# Altium project flatsat_platform_2.PrjPcb (part 2 of 3)

## Sheet power_schematic.SchDoc: Power circuits
size A3; ProjectCode: FLATSAT2; Organization: Altium Limited; Address1: L3, 12a Rodborough Rd; Address2: Frenchs Forest; Address3: NSW; Address4: Australia 2086; DocumentNumber: 6; SheetNumber: 6; SheetTotal: 8
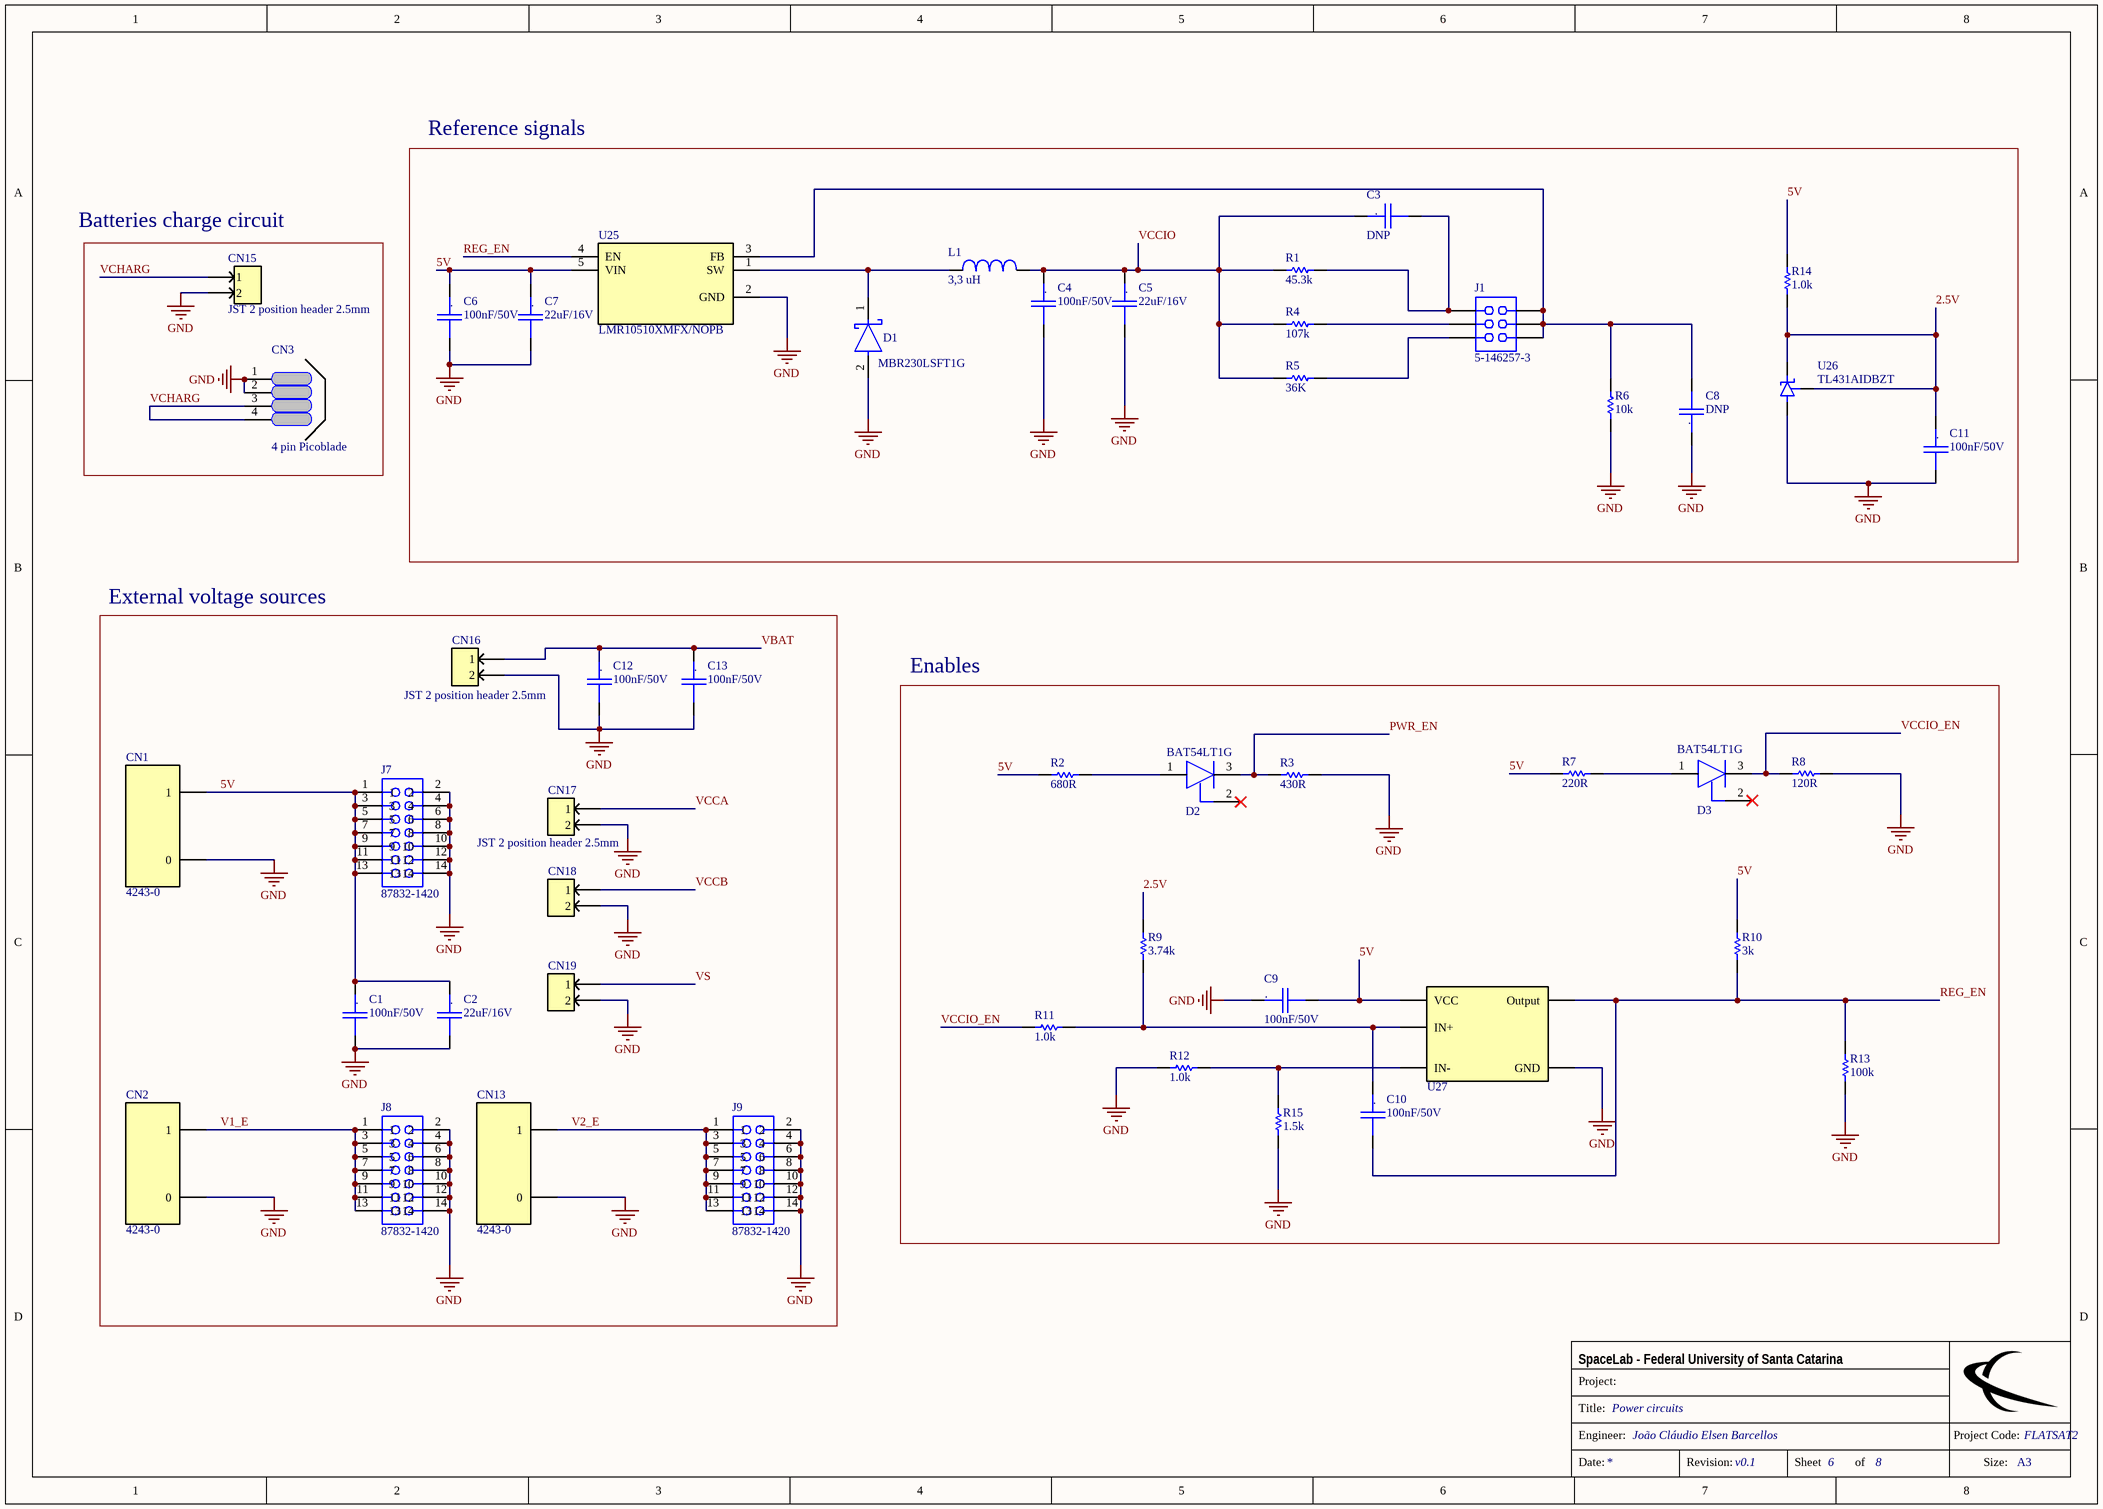
[diagram p7: power_schematic.SchDoc]

### Parts
C1  100nF/50V  [CC0603]
C2  22uF/16V  [CC1210]
C3  DNP  [CC0805]
C4  100nF/50V  [CC0603]
C5  22uF/16V  [CC1210]
C6  100nF/50V  [CC0603]
C7  22uF/16V  [CC1210]
C8  DNP  [CC0805]
C9  100nF/50V  [CC0603]
C10  100nF/50V  [CC0603]
C11  100nF/50V  [CC0603]
C12  100nF/50V  [CC0603]
C13  100nF/50V  [CC0603]
CN1  4243-0  [4243-0]
CN2  4243-0  [4243-0]
CN3  4 pin Picoblade  [PICO BLADE 0533980471]
CN13  4243-0  [4243-0]
CN15  JST 2 position header 2.5mm  [B2B-XH-A-M(LF)(SN)]
CN16  JST 2 position header 2.5mm  [B2B-XH-A-M(LF)(SN)]
CN17  JST 2 position header 2.5mm  [B2B-XH-A-M(LF)(SN)]
CN18  JST 2 position header 2.5mm  [B2B-XH-A-M(LF)(SN)]  (value not drawn)
CN19  JST 2 position header 2.5mm  [B2B-XH-A-M(LF)(SN)]  (value not drawn)
D1  MBR230LSFT1G  [On_Semiconductor_498_MFG]
D2  BAT54LT1G  [SOT95P237X112-3N]
D3  BAT54LT1G  [SOT95P237X112-3N]
J1  5-146257-3  [TE_5-146257-3]
J7  87832-1420  [SAMTEC_TSW-107-05-F-D]
J8  87832-1420  [SAMTEC_TSW-107-05-F-D]
J9  87832-1420  [SAMTEC_TSW-107-05-F-D]
L1  3,3 uH  [SRR6038]
R1  45.3k  [0805]
R2  680R  [0805]
R3  430R  [0805]
R4  107k  [0805]
R5  36K  [0805]
R6  10k  [0805]
R7  220R  [0805]
R8  120R  [0805]
R9  3.74k  [0805]
R10  3k  [0805]
R11  1.0k  [0805]
R12  1.0k  [0805]
R13  100k  [0805]
R14  1.0k  [0805]
R15  1.5k  [0805]
U25  LMR10510XMFX/NOPB  [SOT95P280X145-5N]
U26  TL431AIDBZT  [SOT95P237X112-3N]
U27  AP331AWG-7  [SOT95P280X145-5N]  (value not drawn)

### Blocks framed on the sheet
Reference signals: C3-C8 C11 D1 J1 L1 R1 R4-R6 R14 U25 U26
External voltage sources: C1 C2 C12 C13 CN1 CN2 CN13 CN16-CN19 J7-J9
Enables: C9 C10 D2 D3 R2 R3 R7-R13 R15 U27

### Nets
GND: C1.2 C2.2 C4.2 C5.2 C6.2 C7.2 C8.1 C9.1 C11.2 C12.2 C13.2 CN1.0 CN2.0 CN3.1 CN3.2 CN13.0 CN15.2 CN16.2 CN17.2 CN18.2 CN19.2 D1.2(A) J7.2 J7.4 J7.6 J7.8 J7.10 J7.12 J7.14 J8.2 J8.4 J8.6 J8.8 J8.10 J8.12 J8.14 J9.2 J9.4 J9.6 J9.8 J9.10 J9.12 J9.14 R3.1 R6.1 R8.1 R12.2 R13.1 R15.1 U25.2(GND) U26.3(ANODE) U27.2(GND)
2.5V: C11.1 R9.2 R14.1 U26.1(CATHODE) U26.2(REF)
5V: C1.1 C2.1 C6.1 C7.1 C9.2 CN1.1 J7.1 J7.3 J7.5 J7.7 J7.9 J7.11 J7.13 R2.2 R7.2 R10.2 R14.2 U25.5(VIN) U27.5(VCC)
PWR_EN: D2.3(C) R3.2
REG_EN: C10.2 R10.1 R13.2 U25.4(EN) U27.4(Output)
V1_E: CN2.1 J8.1 J8.3 J8.5 J8.7 J8.9 J8.11 J8.13
V2_E: CN13.1 J9.1 J9.3 J9.5 J9.7 J9.9 J9.11 J9.13
VBAT: C12.1 C13.1 CN16.1
VCCA: CN17.1
VCCB: CN18.1
VCCIO: C3.1 C4.1 C5.1 L1.2 R1.2 R4.2 R5.2
VCCIO_EN: D3.3(C) R8.2 R11.2
VCHARG: CN3.3 CN3.4 CN15.1
VS: CN19.1
NetC3_2: C3.2 J1.1 R1.1
NetC8_2: C8.2 J1.2 J1.4 J1.6 R6.2 U25.3(FB)
NetC10_1: C10.1 R9.1 R11.1 U27.3(IN+)
NetD1_1: D1.1(C) L1.1 U25.1(SW)
NetD2_1: D2.1(A) R2.1
NetD3_1: D3.1(A) R7.1
NetJ1_3: J1.3 R4.1
NetJ1_5: J1.5 R5.1
NetR12_1: R12.1 R15.2 U27.1(IN-)

Not connected (* = marked no-connect by the designer): D2 2(NC)*; D3 2(NC)*

### Notes on the sheet
- (near CN15) Batteries charge circuit
- Project:
- SpaceLab - Federal University of Santa Catarina
- Title:
- Engineer:
- Project Code:
- Date:
- Revision:
- Sheet
- of
- Size:
- A3
- (in symbol Cap_Cer_X7R_22uF_16V_1210) .
- (in symbol Cap_Cer_X7R_100nF_50V_0603) .
- (in symbol Cap_DNP_0805) .

### Library data of the parts
C1 C4 C6 C9-C13 = Cap_Cer_X7R_100nF_50V_0603: CAP CER 100nF 50V 10% X7R 0603; Manufacturer Part Number: C0603C104K5RAC3121; NCM: 8532.24.10
C2 C5 C7 = Cap_Cer_X7R_22uF_16V_1210: CAP CER 22uF 16V 10% X7R 1210; Manufacturer Part Number: C3225X7R1C226K250AC; NCM: 8532.24.10
C3 C8 = Cap_DNP_0805: CAP DNP 0805; NCM: 8532.24.10
CN1 CN2 CN13 = 4243-0: POMONA, 4243-0, Binding Post, 4243 Series, 15 A, 60 VDC, Tin Plated Contacts, Brass, Black; Manufacturer: Pomona Electronics; Voltage Rating: 2.5kV; Current Rating: 15A; Voltage Rating (DC): 60V; Voltage Rating (AC): 30V; Insulation: Insulated; Number of Ports: 2; Hole Diameter: 0.1inch; Panel Thickness: 6.35mm; Supplier 1: Digi-Key; Manufacturer Part Number: 4243-0; RoHS: Yes; Category: Connectors; Stock 1: 327; Pricing 1: 1=8.99000, 25=8.54040, 50=8.09100, 100=7.73150 (USD); Mount: Panel; Number of Pins: 1; Contact Plating: Tin,Bright; Contact Material: Brass; Color: Black,Red; Housing Material: Polycarbonate; Housing Color: Black; Body Material: Brass; Insulation Material: Polycarbonate; Package Quantity: 5; Packaging: Bulk; Termination: Turret; Orientation: Straight; Max Current Rating: 15A; Length: 30.23mm; Depth: 11.18mm; REACH SVHC: No SVHC; Lead Free: Lead Free; ComponentLink1URL: https://datasheet.ciiva.com/1453/d4243-1-01-1453890.pdf?src-supplier=Element14; ComponentLink1Description: https://datasheet.ciiva.com/1453/d4243-1-01-1453890.pdf?src-supplier=Element14; ComponentLink2URL: https://datasheet.ciiva.com/16883/70198115-16883751.pdf?src-supplier=Allied+Electronics; ComponentLink2Description: https://datasheet.ciiva.com/16883/70198115-16883751.pdf?src-supplier=Allied+Electronics; ComponentLink3URL: https://datasheet.ciiva.com/30105/d4243-1-02-30105753.pdf?src-supplier=Onlinecomponents.com; ComponentLink3Description: https://datasheet.ciiva.com/30105/d4243-1-02-30105753.pdf?src-supplier=Onlinecomponents.com; Supplier Part Number 1: 501-1126-ND
CN3 = 0533980471: 1.25mm Pitch PicoBlade™ Header, Surface Mount, Vertical, 4 Circuits; Manufacturer: Molex; Manufacturer Part Number: 53398-0471; N of Positions: 4; Body Plating: Tin; Gender: Male; Current Rating: 1A; Voltage Rating: 125V; Contact Resistance: 20mR; Insulation Resistance: 100MR; Glow Wire Compliant: Non-compliant; Pitch: 1.25mm; Mount Type: SMD; Value: 0533980471; Supplier 1: Digi-Key; Supplier Part Number 1: WM7608CT-ND; Stock 1: 21236; Pricing 1: 1=1.19, 10=1.044, 100=0.901, 500=0.73716 (USD); Mount: Surface Mount; Contact Plating: Tin; Contact Material: Bronze,Tin,Brass; Color: Natural; Housing Color: Natural; Housing Material: Nylon; Min Operating Temperature: -40°C; Max Operating Temperature: 85°C; Number of Rows: 1; Packaging: Tape and Reel; Number of Positions: 4; Termination: Solder; Package Quantity: 1000; Voltage Rating (AC): 125V; Number of Contacts: 4; Working Voltage: 125V; Orientation: Vertical; Number of Circuits: 4; Voltage Rating (DC): 125V; Lead Pitch: 1.25mm; Radiation Hardening: No; Flammability Rating: UL94 V-0; REACH SVHC: Unknown; Lead Free: Lead Free; ComponentLink1URL: http://www.mouser.com/ds/2/276/0533980471_PCB_HEADERS-171069.pdf?src-supplier=Mouser; ComponentLink1Description: http://www.mouser.com/ds/2/276/0533980471_PCB_HEADERS-171069.pdf?src-supplier=Mouser; ComponentLink2URL: http://www.jameco.com/Jameco/Products/ProdDS/1932627.pdf?src-supplier=Jameco; ComponentLink2Description: http://www.jameco.com/Jameco/Products/ProdDS/1932627.pdf?src-supplier=Jameco; ComponentLink3URL: https://www.distrelec.biz/Web/Downloads/46/_e/gf116833-116846_e.pdf?mime=application%2Fpdf&src-supplier=Distrelec; ComponentLink3Description: https://www.distrelec.biz/Web/Downloads/46/_e/gf116833-116846_e.pdf?mime=application%2Fpdf&src-supplier=Distrelec; ComponentLink4URL: http://www.molex.com/webdocs/datasheets/pdf/en-us/0533980471_PCB_HEADERS.pdf?src-supplier=Element14; ComponentLink4Description: http://www.molex.com/webdocs/datasheets/pdf/en-us/0533980471_PCB_HEADERS.pdf?src-supplier=Element14; ComponentLink5URL: http://www.farnell.com/datasheets/1867381.pdf?src-supplier=Element14; ComponentLink5Description: http://www.farnell.com/datasheets/1867381.pdf?src-supplier=Element14; ComponentLink6URL: http://uk.rs-online.com/webdocs/13c4/0900766b813c4500.pdf?src-supplier=RSComponents; ComponentLink6Description: http://uk.rs-online.com/webdocs/13c4/0900766b813c4500.pdf?src-supplier=RSComponents; ComponentLink7URL: http://www.molex.com/webdocs/datasheets/pdf/en-us/0533980471_PCB_HEADERS.pdf?src-supplier=Farnell; ComponentLink7Description: http://www.molex.com/webdocs/datasheets/pdf/en-us/0533980471_PCB_HEADERS.pdf?src-supplier=Farnell; ComponentLink8URL: http://www.farnell.com/datasheets/2697809.pdf?src-supplier=Element14; ComponentLink8Description: http://www.farnell.com/datasheets/2697809.pdf?src-supplier=Element14; ComponentLink9URL: http://www.molex.com/webdocs/datasheets/pdf/en-us/0533980471_PCB_HEADERS.pdf?src-supplier=Avnet; ComponentLink9Description: http://www.molex.com/webdocs/datasheets/pdf/en-us/0533980471_PCB_HEADERS.pdf?src-supplier=Avnet; ComponentLink10URL: http://www.molex.com/webdocs/datasheets/pdf/en-us/0533980471_PCB_HEADERS.pdf?src-supplier=Avnet+Europe; ComponentLink10Description: http://www.molex.com/webdocs/datasheets/pdf/en-us/0533980471_PCB_HEADERS.pdf?src-supplier=Avnet+Europe; Supplier 2: Mouser; Supplier Part Number 2: 538-53398-0471; Stock 2: 43680; Pricing 2: 1=0.98, 10=0.832, 100=0.716, 500=0.6, 1000=0.391, 2000=0.342 (USD)
CN15-CN19 = B2B-XH-A-M(LF)(SN): CONN HEADER TOP 2POS 2.5MM GRN; Number of Positions: 2; Connector Type: Male Pin; Pitch: 0.098inch; Supplier 1: Digi-Key; Supplier Part Number 1: 455-2879-ND; Manufacturer: JST; Stock 1: 5564; Pricing 1: 1=0.17, 10=0.157, 100=0.0966, 500=0.07998, 1000=0.06999, 5000=0.05999, 10000=0.05832 (USD); Mount: Through Hole; Color: Natural; Contact Plating: Tin; Packaging: Bulk; Number of Rows: 1; Termination: Press-Fit; Fastening Type: Detent; Package Quantity: 1000; Manufacturer Part Number: B2B-XH-A-M(LF)(SN); ComponentLink1Description: http://www.jst-mfg.com/product/pdf/eng/eXH.pdf; ComponentLink1URL: http://www.jst-mfg.com/product/pdf/eng/eXH.pdf
J1 = 5-146257-3: Header; Breakaway; 0.100 x 0.100 in.; PC Board; Dual; 6; 0.025 in.; 0.12 in.; Product_Type: Connector; Number_of_Positions: 6; MF: TE Connectivity; Centerline_Pitch: 2.54 mm[.1 in]; Package: None; EU_RoHS_Compliance: Compliant; DigiKey-Purchase-URL: https://snapeda.com/shop?store=DigiKey&id=338021; Value: *; Mouser-Purchase-URL: https://snapeda.com/shop?store=Mouser&id=338021; Availability: Warning; Price: None; SnapEDA_Link: https://www.snapeda.com/parts/5-146257-3/TE%20Connectivity%20AMP%20Connectors/view-part/338021/?ref=snap; Manufacturer Part Number: 5-146257-3
J7-J9 = 87832-1420: Connector Header Surface Mount 14 position 0.079 _2.00mm_; Manufacturer Part Number: TSW-107-05-F-D; MF: Molex; Value: *; SnapEDA_Link: https://www.snapeda.com/parts/87832-1420/Molex/view-part/78740/?ref=snap; Price: None; Package: None; Availability: Unavailable
L1 = 3,3 uH: 3.3ÂµH Shielded Wirewound Inductor 3.5A 20mOhm Max Nonstandard; Manufacturer Part Number: SRR6038-3R3Y; MF: Bourns; Value: *; Availability: Unavailable; Price: None; SnapEDA_Link: https://www.snapeda.com/parts/SRR6038-3R3Y/Bourns/view-part/885274/?ref=snap; Package: Nonstandard Bourns
R1 = R45.3k_1%_1/10W_0805: RES 45.3K OHM 1/8W 1% 0805; Manufacturer Part Number: RC0805FR-0745K3L; NCM: 8533.21.20
R2 = R680R_1%_1/8W_0805: RES 680R OHM 1/8W 1% 0805; Manufacturer Part Number: CRGCQ0805F680R; NCM: 8533.21.20
R3 = R430R_1%_1/4W_0805: RES 430R OHM 1/8W 0.1% 0805; Manufacturer Part Number: RT0805BRD07430RL; NCM: 8533.21.20
R4 = R107k_1%_1/8W_0805: RES 107K OHM 1/8W 1% 0805; Manufacturer Part Number: RC0805FR-07107KL; NCM: 8533.21.20
R5 = R36K_1%_1/10W_0805: RES 36K OHM 1/8W 0.1% 0805; Manufacturer Part Number: RG2012N-363-B-T5; NCM: 8533.21.20
R6 = R10k_1%_1/8W_0805: RES 10K OHM 1/8W 1%  0805; Manufacturer Part Number: CRCW080510K0FKEA; NCM: 8533.21.20
R7 = R220R_1%_1/8W_0805: RES 220R OHM 1/8W 1% 0805; Manufacturer Part Number: CRCW0805220RFKEA; NCM: 8533.21.20
R8 = R120R_1%_1/4W_0805: RES 120R OHM 1/8W 1% 0805; Manufacturer Part Number: CRGCQ0805F120R; NCM: 8533.21.20
R9 = R3.74k_1%_1/8W_0805: RES 3.74K OHM 1/8W 0.5% 0805; Manufacturer Part Number: RT0805DRE073K74L; NCM: 8533.21.20
R10 = R3.0k_1%_1/8W_0805: RES 3.0K OHM 1/10W 0.1% 0805; Manufacturer Part Number: ERA-6YEB302V; NCM: 8533.21.20
R11 R12 R14 = R1.0k_1%_1/8W_0805: RES 1.0K OHM 1/8W 1% 0805; Manufacturer Part Number: RC0805FR-071KL; NCM: 8533.21.20
R13 = R100k_1%_1/8W_0805: RES 100K OHM 1/8W 1% 0805; Manufacturer Part Number: AC0805FR-13100KL; NCM: 8533.21.20
R15 = R1.5K_1%_1/10W_0805: RES 1.5K OHM 1/10W 0.1% 0805; Manufacturer Part Number: RN73C2A1K5BTDF; NCM: 8533.21.20
U26 = TL431AIDBZT: Shunt Voltage Reference IC 36V Â±1% SOT-23-3; MF: Texas Instruments; SnapEDA_Link: https://www.snapeda.com/parts/TL431AIDBZT/Texas%20Instruments/view-part/277644/?ref=snap; Package: SOT-23-3 Texas Instruments; Price: None; Value: *; Availability: Unavailable; Manufacturer Part Number: TL431AIDBZT
D1 = MBR230LSFT1G: Manufacturer Part Number: MBR230LSFT1G
D2 D3 = BAT54LT1G: Manufacturer Part Number: BAT54LT1G
U25 = LMR10510XMFX/NOPB: Package: None; Price: None; Value: *; Availability: Unavailable; Manufacturer Part Number: LMR10510XMFX/NOPB
U27 = AP331AWG-7: Manufacturer Part Number: AP331AWG-7

## Sheet kill-switches_schematic.SchDoc: Kill-Switches
size A4; Organization: UFSC; DocumentNumber: 7; Revision: v0.1; SheetNumber: 7; SheetTotal: 8; ProjectCode: FLATSAT2
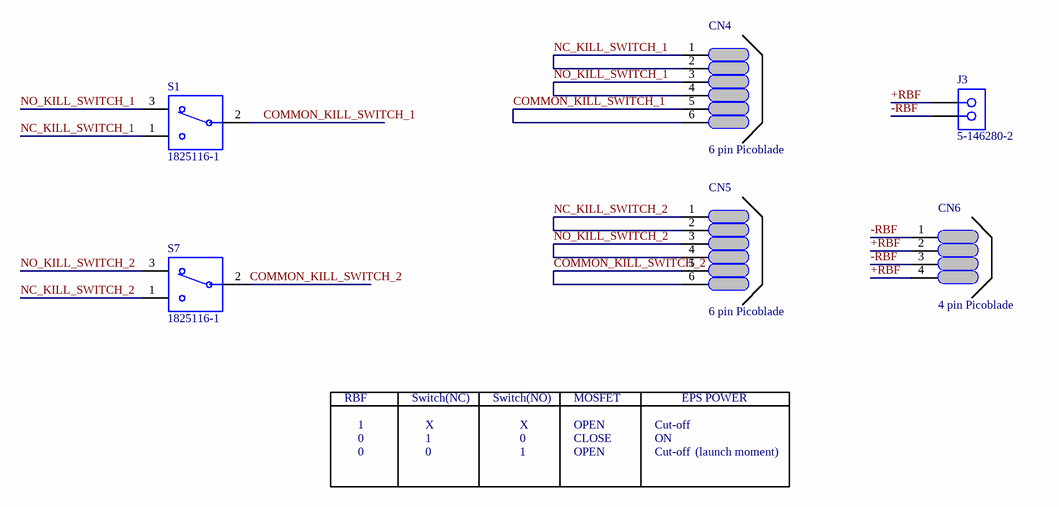
[diagram p8: kill-switches_schematic.SchDoc]

### Parts
CN4  6 pin Picoblade  [PICO BLADE 0533980671]
CN5  6 pin Picoblade  [PICO BLADE 0533980671]
CN6  4 pin Picoblade  [PICO BLADE 0533980471]
J3  5-146280-2  [PIN BAR 2 2.54mm 180 GRAUS]
S1  1825116-1  [SW_1825116-1]
S7  1825116-1  [SW_1825116-1]

### Nets
+RBF: CN6.2 CN6.4 J3.1
-RBF: CN6.1 CN6.3 J3.2
COMMON_KILL_SWITCH_1: CN4.5 CN4.6 S1.2
COMMON_KILL_SWITCH_2: CN5.5 CN5.6 S7.2
NC_KILL_SWITCH_1: CN4.1 CN4.2 S1.1
NC_KILL_SWITCH_2: CN5.1 CN5.2 S7.1
NO_KILL_SWITCH_1: CN4.3 CN4.4 S1.3
NO_KILL_SWITCH_2: CN5.3 CN5.4 S7.3

### Notes on the sheet
- RBF
- Switch(NC)
- Switch(NO)
- MOSFET
- EPS POWER
- 1
- 0
- X
- OPEN
- CLOSE
- Cut-off
- ON
- (launch moment)
- Project:
- SpaceLab - Federal University of Santa Catarina
- Title:
- Designed by:
- Project Code:
- Date:
- Revision:
- Sheet
- of
- Size:
- A4

### Library data of the parts
CN4 CN5 = 53398-0671: 1.25mm Pitch PicoBlade™ Header, Surface Mount, Vertical, 6 Circuits; Manufacturer: Molex; Body Plating: Tin; Contact Resistance: 20mR; Voltage Rating: 125V; Current Rating: 1A; Number of Positions: 6; Insulation Resistance: 100MR; Gender: Male; Glow Wire Compliant: Non-compliant; Supplier 1: Digi-Key; Supplier Part Number 1: WM7610DKR-ND; Stock 1: 21086; Pricing 1: 1=1.39, 10=1.26, 100=1.0802, 500=0.90014 (USD); Mount: Surface Mount; Color: Natural; Contact Plating: Tin; Contact Material: Bronze,Tin; Housing Color: Natural; Housing Material: Nylon; Min Operating Temperature: -40°C; Max Operating Temperature: 85°C; Packaging: Tape and Reel; Number of Rows: 1; Voltage Rating (AC): 125V; Package Quantity: 1000; Termination: Solder; Number of Contacts: 6; Working Voltage: 125V; Orientation: Vertical; Number of Circuits: 6; Voltage Rating (DC): 125V; Lead Pitch: 1.25mm; Pitch: 1.25mm; Radiation Hardening: No; REACH SVHC: Unknown; Lead Free: Lead Free; Flammability Rating: UL94 V-0; ComponentLink1URL: https://www.molex.com/pdm_docs/sd/533980671_sd.pdf?src-supplier=Digi-Key; ComponentLink1Description: https://www.molex.com/pdm_docs/sd/533980671_sd.pdf?src-supplier=Digi-Key; Supplier 2: Mouser; Supplier Part Number 2: 538-53398-0671; Stock 2: 26; Pricing 2: 1=1.15, 10=1.01, 100=0.864, 500=0.727, 1000=0.427, 2000=0.374 (USD); Manufacturer Part Number: 53398-0671
CN6 = 0533980471: as CN3 on sheet power_schematic; Pitch: 1.25mm; Mount Type: SMD; Value: 0533980471; Supplier 1: Digi-Key; Supplier Part Number 1: WM7608CT-ND; Stock 1: 21236; Pricing 1: 1=1.19, 10=1.044, 100=0.901, 500=0.73716 (USD); Mount: Surface Mount; Contact Plating: Tin; Contact Material: Bronze,Tin,Brass; Color: Natural; Housing Color: Natural; Housing Material: Nylon; Min Operating Temperature: -40°C; Max Operating Temperature: 85°C; Number of Rows: 1; Packaging: Tape and Reel; Number of Positions: 4; Termination: Solder; Package Quantity: 1000; Voltage Rating (AC): 125V; Number of Contacts: 4; Working Voltage: 125V; Orientation: Vertical; Number of Circuits: 4; Voltage Rating (DC): 125V; Lead Pitch: 1.25mm; Radiation Hardening: No; Flammability Rating: UL94 V-0; REACH SVHC: Unknown; Lead Free: Lead Free; ComponentLink1URL: http://www.mouser.com/ds/2/276/0533980471_PCB_HEADERS-171069.pdf?src-supplier=Mouser; ComponentLink1Description: http://www.mouser.com/ds/2/276/0533980471_PCB_HEADERS-171069.pdf?src-supplier=Mouser; ComponentLink2URL: http://www.jameco.com/Jameco/Products/ProdDS/1932627.pdf?src-supplier=Jameco; ComponentLink2Description: http://www.jameco.com/Jameco/Products/ProdDS/1932627.pdf?src-supplier=Jameco; ComponentLink3URL: https://www.distrelec.biz/Web/Downloads/46/_e/gf116833-116846_e.pdf?mime=application%2Fpdf&src-supplier=Distrelec; ComponentLink3Description: https://www.distrelec.biz/Web/Downloads/46/_e/gf116833-116846_e.pdf?mime=application%2Fpdf&src-supplier=Distrelec; ComponentLink4URL: http://www.molex.com/webdocs/datasheets/pdf/en-us/0533980471_PCB_HEADERS.pdf?src-supplier=Element14; ComponentLink4Description: http://www.molex.com/webdocs/datasheets/pdf/en-us/0533980471_PCB_HEADERS.pdf?src-supplier=Element14; ComponentLink5URL: http://www.farnell.com/datasheets/1867381.pdf?src-supplier=Element14; ComponentLink5Description: http://www.farnell.com/datasheets/1867381.pdf?src-supplier=Element14; ComponentLink6URL: http://uk.rs-online.com/webdocs/13c4/0900766b813c4500.pdf?src-supplier=RSComponents; ComponentLink6Description: http://uk.rs-online.com/webdocs/13c4/0900766b813c4500.pdf?src-supplier=RSComponents; ComponentLink7URL: http://www.molex.com/webdocs/datasheets/pdf/en-us/0533980471_PCB_HEADERS.pdf?src-supplier=Farnell; ComponentLink7Description: http://www.molex.com/webdocs/datasheets/pdf/en-us/0533980471_PCB_HEADERS.pdf?src-supplier=Farnell; ComponentLink8URL: http://www.farnell.com/datasheets/2697809.pdf?src-supplier=Element14; ComponentLink8Description: http://www.farnell.com/datasheets/2697809.pdf?src-supplier=Element14; ComponentLink9URL: http://www.molex.com/webdocs/datasheets/pdf/en-us/0533980471_PCB_HEADERS.pdf?src-supplier=Avnet; ComponentLink9Description: http://www.molex.com/webdocs/datasheets/pdf/en-us/0533980471_PCB_HEADERS.pdf?src-supplier=Avnet; ComponentLink10URL: http://www.molex.com/webdocs/datasheets/pdf/en-us/0533980471_PCB_HEADERS.pdf?src-supplier=Avnet+Europe; ComponentLink10Description: http://www.molex.com/webdocs/datasheets/pdf/en-us/0533980471_PCB_HEADERS.pdf?src-supplier=Avnet+Europe; Supplier 2: Mouser; Supplier Part Number 2: 538-53398-0471; Stock 2: 43680; Pricing 2: 1=0.98, 10=0.832, 100=0.716, 500=0.6, 1000=0.391, 2000=0.342 (USD)
J3 = 5-146280-2: 02 MODII HDR SRST B/A .100CL; MF: TE Connectivity; Product_Type: Connector; Number_of_Positions: 2; Centerline_Pitch: 2.54 mm[.1 in]; SnapEDA_Link: https://www.snapeda.com/parts/5-146280-2/TE%20Connectivity%20AMP%20Connectors/view-part/298520/?ref=snap; Price: None; EU_RoHS_Compliance: Compliant; Package: None; Availability: Unavailable; TE_purchase_URL: https://www.te.com/usa-en/product-5-146280-2.html?te_bu=Cor&te_type=disp&te_campaign=seda_glo_cor-seda-global-disp-prtnr-fy19-seda-model-bom-cta_sma-317_1&elqCampaignId=32493; Value: *; Manufacturer Part Number: 5-146280-2
S1 S7 = 1825116-1: Slide Switch SPDT Through Hole, Right Angle; MF: TE Connectivity; Price: None; Value: *; EU_RoHS_Compliance: Compliant; Package: None; TE_purchase_URL: https://www.te.com/usa-en/product-1825116-1.html?te_bu=Cor&te_type=disp&te_campaign=seda_glo_cor-seda-global-disp-prtnr-fy19-seda-model-bom-cta_sma-317_1&elqCampaignId=32493; SnapEDA_Link: https://www.snapeda.com/parts/1825116-1/TE%20Connectivity%20ALCOSWITCH%20Switches/view-part/497270/?ref=snap; Availability: Unavailable; Manufacturer Part Number: 1825116-1

## Sheet USB_debug_schematic.SchDoc: USB UART debug circuit
size A3; ProjectCode: FLATSAT2; Organization: Altium Limited; Address1: L3, 12a Rodborough Rd; Address2: Frenchs Forest; Address3: NSW; Address4: Australia 2086; DocumentNumber: 8; SheetNumber: 8; SheetTotal: 8
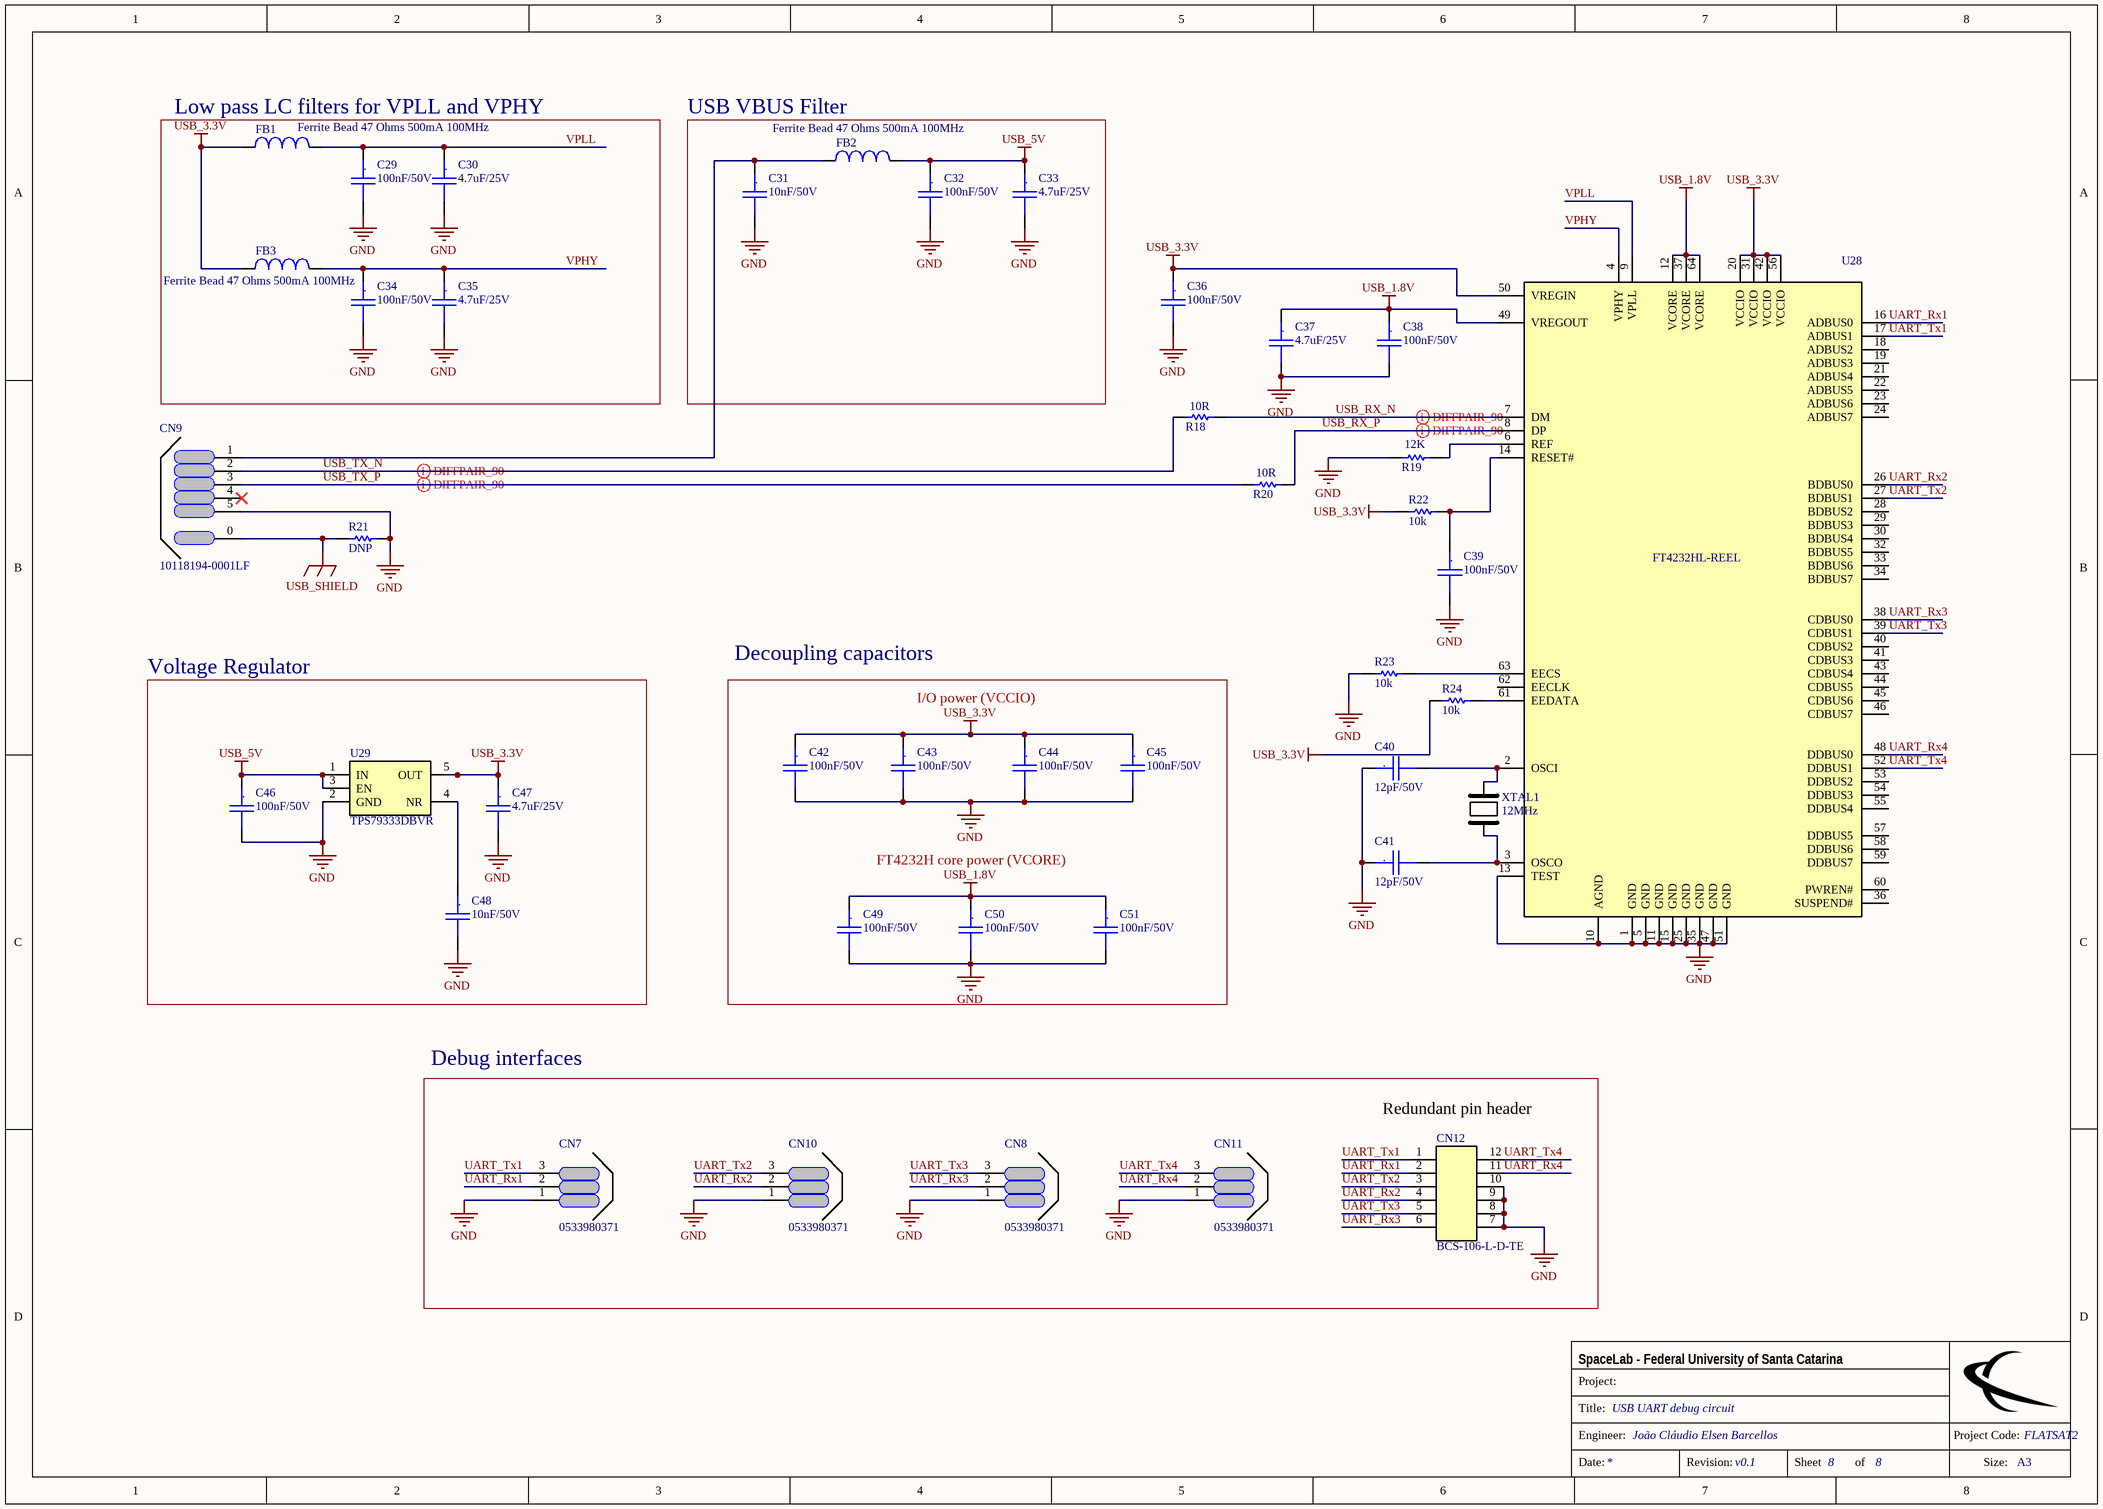
[diagram p9: USB_debug_schematic.SchDoc]

### Parts
C29  100nF/50V  [CC0603]
C30  4.7uF/25V  [CC0805]
C31  10nF/50V  [CC0805]
C32  100nF/50V  [CC0603]
C33  4.7uF/25V  [CC0805]
C34  100nF/50V  [CC0603]
C35  4.7uF/25V  [CC0805]
C36  100nF/50V  [CC0603]
C37  4.7uF/25V  [CC0805]
C38  100nF/50V  [CC0603]
C39  100nF/50V  [CC0603]
C40  12pF/50V  [CC0805]
C41  12pF/50V  [CC0805]
C42  100nF/50V  [CC0603]
C43  100nF/50V  [CC0603]
C44  100nF/50V  [CC0603]
C45  100nF/50V  [CC0603]
C46  100nF/50V  [CC0603]
C47  4.7uF/25V  [CC0805]
C48  10nF/50V  [CC0805]
C49  100nF/50V  [CC0603]
C50  100nF/50V  [CC0603]
C51  100nF/50V  [CC0603]
CN7  0533980371  [PICO BLADE 0533980371]
CN8  0533980371  [PICO BLADE 0533980371]
CN9  10118194-0001LF  [MICRO USB B 90GRAUS]
CN10  0533980371  [PICO BLADE 0533980371]
CN11  0533980371  [PICO BLADE 0533980371]
CN12  BCS-106-L-D-TE  [BCS-106-L-D-TE]
FB1  Ferrite Bead 47 Ohms 500mA 100MHz  [L0603]
FB2  Ferrite Bead 47 Ohms 500mA 100MHz  [L0603]
FB3  Ferrite Bead 47 Ohms 500mA 100MHz  [L0603]
R18  10R  [R0603_MD]
R19  12K  [R0805_MD]
R20  10R  [R0603_MD]
R21  DNP  [0805]
R22  10k  [0805]
R23  10k  [0805]
R24  10k  [0805]
U28  FT4232HL-REEL  [LQFP-64]
U29  TPS79333DBVR  [SOT23-5]
XTAL1  Frequency: 12MHz  [TXC 7A Series]  (hidden comment: 12.000MHz 12pF)

### Blocks framed on the sheet
Low pass LC filters for VPLL and VPHY: C29 C30 C34 C35 FB1 FB3
USB VBUS Filter: C31-C33 FB2
Voltage Regulator: C46-C48 U29
Decoupling capacitors: C42-C45 C49-C51
Debug interfaces: CN7 CN8 CN10-CN12

### Nets
GND: C29.2 C30.2 C31.2 C32.2 C33.2 C34.2 C35.2 C36.2 C37.2 C38.2 C39.2 C40.1 C41.1 C42.2 C43.2 C44.2 C45.2 C46.2 C47.2 C48.2 C49.2 C50.2 C51.2 CN7.1 CN8.1 CN9.5 CN10.1 CN11.1 CN12.7 CN12.8 CN12.9 CN12.10 R19.1 R21.1 R23.2 U28.1(GND) U28.5(GND) U28.10(AGND) U28.11(GND) U28.13(TEST) U28.15(GND) U28.25(GND) U28.35(GND) U28.47(GND) U28.51(GND) U29.2(GND)
USB_1.8V: C37.1 C38.1 C49.1 C50.1 C51.1 U28.12(VCORE) U28.37(VCORE) U28.49(VREGOUT) U28.64(VCORE)
USB_3.3V: C36.1 C42.1 C43.1 C44.1 C45.1 C47.1 FB1.1 FB3.1 R22.2 R24.2 U28.20(VCCIO) U28.31(VCCIO) U28.42(VCCIO) U28.50(VREGIN) U28.56(VCCIO) U29.5(OUT)
USB_5V: C32.1 C33.1 C46.1 FB2.2 U29.1(IN) U29.3(EN)
USB_SHIELD: CN9.0 R21.2
UART_Rx1: CN7.2 CN12.2 U28.16(ADBUS0)
UART_Rx2: CN10.2 CN12.4 U28.26(BDBUS0)
UART_Rx3: CN8.2 CN12.6 U28.38(CDBUS0)
UART_Rx4: CN11.2 CN12.11 U28.48(DDBUS0)
UART_Tx1: CN7.3 CN12.1 U28.17(ADBUS1)
UART_Tx2: CN10.3 CN12.3 U28.27(BDBUS1)
UART_Tx3: CN8.3 CN12.5 U28.39(CDBUS1)
UART_Tx4: CN11.3 CN12.12 U28.52(DDBUS1)
USB_RX_N: R18.2 U28.7(DM)
USB_RX_P: R20.2 U28.8(DP)
USB_TX_N: CN9.2 R18.1
USB_TX_P: CN9.3 R20.1
VPHY: C34.1 C35.1 FB3.2 U28.4(VPHY)
VPLL: C29.1 C30.1 FB1.2 U28.9(VPLL)
NetC31_1: C31.1 CN9.1 FB2.1
NetC39_1: C39.1 R22.1 U28.14(RESET#)
NetC40_2: C40.2 U28.2(OSCI) XTAL1.1
NetC41_2: C41.2 U28.3(OSCO) XTAL1.2
NetC48_1: C48.1 U29.4(NR)
NetR19_2: R19.2 U28.6(REF)
NetR23_1: R23.1 U28.63(EECS)
NetR24_1: R24.1 U28.61(EEDATA)

Not connected (* = marked no-connect by the designer): CN9 4*; U28 18(ADBUS2) 19(ADBUS3) 21(ADBUS4) 22(ADBUS5) 23(ADBUS6) 24(ADBUS7) 28(BDBUS2) 29(BDBUS3) 30(BDBUS4) 32(BDBUS5) 33(BDBUS6) 34(BDBUS7) 36(SUSPEND#) 40(CDBUS2) 41(CDBUS3) 43(CDBUS4) 44(CDBUS5) 45(CDBUS6) 46(CDBUS7) 53(DDBUS2) 54(DDBUS3) 55(DDBUS4) 57(DDBUS5) 58(DDBUS6) 59(DDBUS7) 60(PWREN#) 62(EECLK)

### Layout directives
differential pair: USB_RX_N, USB_RX_P, USB_TX_N, USB_TX_P

### Notes on the sheet
- I/O power (VCCIO)
- FT4232H core power (VCORE)
- (near CN12) Redundant pin header
- Project:
- SpaceLab - Federal University of Santa Catarina
- Title:
- Engineer:
- Project Code:
- Date:
- Revision:
- Sheet
- of
- Size:
- A3
- (in symbol Cap_Cer_X7R_4.7uF_25V_0805) .
- (in symbol Cap_Cer_X7R_10nF_50V_0805) .
- (in symbol Cap_Cer_X7R_12pF_50V_0805) .
- (in symbol Cap_Cer_X7R_100nF_50V_0603) .

### Library data of the parts
C29 C32 C34 C36 C38 C39 C42-C46 C49-C51 = Cap_Cer_X7R_100nF_50V_0603: as C1 on sheet power_schematic; NCM: 8532.24.10
C30 C33 C35 C37 C47 = Cap_Cer_X7R_4.7uF_25V_0805: CAP CER 4.7uF 25V 10% X7R 0805; Manufacturer Part Number: C0805C475K3RACAUTO; NCM: 8532.24.10
C31 C48 = Cap_Cer_X7R_10nF_50V_0805: CAP CER 0.01uF 50V 10% X7R 0805; Manufacturer Part Number: 08055C103KAT4A; NCM: 8532.24.10
C40 C41 = Cap_Cer_X7R_12pF_50V_0805: CAP CER 12pF 50V 1% C0G/NP0 0805; Manufacturer Part Number: CL21C120FBANNNC; NCM: 8532.24.10
CN7 CN8 CN10 CN11 = 0533980371: CONN HEADER SMD 3POS 1.25MM; Manufacturer: Molex; Manufacturer Part Number: 53398-0371; N of Positions: 3; Pitch: 1.25mm; Mount Type: SMD; Value: 0533980371
CN9 = 10118194-0001LF: CONN USB MICRO B RECPT SMT R/A; Manufacturer: FCI; N of Positions: 5; Pitch: 0.65mm; Mount Type: PTH; Supplier 1: Digi-Key; Supplier 2: Farnell; Supplier 3: Mouser; Supplier 4: Newark; Supplier Part Number 1: 609-4618-1-ND; Supplier Part Number 2: 1645325; Supplier Part Number 3: 649-10118194-0001LF; Supplier Part Number 4: 67T2260; Manufacturer Part Number: 10118194-0001LF
CN12 = BCS-106-L-D-TE: CONN RCPT 12POS 0.1 GOLD PCB; Manufacturer: Samtec; Number of Contacts: 12; Gender: Receptacle; Max Current Rating: 5.9A; Contact Resistance: 10mR; Max Voltage Rating (AC): 475V; Pitch: 2.54mm; Row Spacing: 0.1inch; Supplier 1: Digi-Key; Manufacturer Part Number: BCS-106-L-D-TE; RoHS: Yes; Category: Connectors; Stock 1: 7411; Pricing 1: 1=1.77000, 10=1.60200, 25=1.50360, 50=1.43820, 100=1.37290, 250=1.24216, 500=1.14408 (USD); Mount: Through Hole; Contact Plating: Gold; Contact Material: Bronze; Color: Black; Housing Color: Black; Housing Material: Polymer; Min Operating Temperature: -55°C; Max Operating Temperature: 125°C; Number of Rows: 2; Termination: Solder; Packaging: Rail/Tube; Connector Type: Receptacle; Number of Positions: 12; Orientation: Vertical; Length: 15.24mm; Depth: 5.08mm; Width: 5.08mm; Radiation Hardening: No; REACH SVHC: No SVHC; Lead Free: Lead Free; ComponentLink1URL: https://datasheet.ciiva.com/16706/bcs-16706444.pdf?src-supplier=Avnet+Europe; ComponentLink1Description: https://datasheet.ciiva.com/16706/bcs-16706444.pdf?src-supplier=Avnet+Europe; ComponentLink2URL: https://datasheet.ciiva.com/413/bcs-1xx-xxx-x-xx-xxx-mkt-413758.pdf?src-supplier=Digi-Key; ComponentLink2Description: https://datasheet.ciiva.com/413/bcs-1xx-xxx-x-xx-xxx-mkt-413758.pdf?src-supplier=Digi-Key; Supplier Part Number 1: SAM1008-06-ND
FB1-FB3 = 742792608: WURTH ELEKTRONIK   742792608   FERRITE BEAD, 47 OHM, 0.5A, 0603; Manufacturer: Wurth Electronics; Resistance: 100mR; Inductance: 1H; Tolerance: 25%; Number of Lines: 1; Supplier 1: Digi-Key; Supplier Part Number 1: 732-1596-1-ND; Stock 1: 969; Pricing 1: 1=0.17, 50=0.168, 100=0.155, 500=0.148, 1000=0.141, 2000=0.134 (USD); Mount: Surface Mount; Case/Package: SMD/SMT; Weight: 0.000141oz; Core Material: Ferrite; Case Code (Metric): 1608; Case Code (Imperial): 0603; Material: Ferrite; Min Operating Temperature: -55°C; Max Operating Temperature: 125°C; Package Quantity: 1; Packaging: Tape and Reel; Max Current Rating: 500mA; DC Resistance (DCR): 100mR; Max DC Current: 500mA; Termination: SMD/SMT; Length: 1.6mm; Height: 0.8mm; Width: 0.8mm; Depth: 0.8mm; REACH SVHC: Unknown; Lead Free: Lead Free; ComponentLink1URL: http://katalog.we-online.de/pbs/datasheet/742792608.pdf?src-supplier=Digi-Key; ComponentLink1Description: http://katalog.we-online.de/pbs/datasheet/742792608.pdf?src-supplier=Digi-Key; ComponentLink2URL: http://www.farnell.com/datasheets/2290671.pdf?src-supplier=Farnell; ComponentLink2Description: http://www.farnell.com/datasheets/2290671.pdf?src-supplier=Farnell; ComponentLink3URL: http://documents.rs-components.com/techlib://itc_doclist_GB.htm?stockno=6693986&src-supplier=RSComponents; ComponentLink3Description: http://documents.rs-components.com/techlib://itc_doclist_GB.htm?stockno=6693986&src-supplier=RSComponents; ComponentLink4URL: http://www.farnell.com/datasheets/1696033.pdf?src-supplier=Element14; ComponentLink4Description: http://www.farnell.com/datasheets/1696033.pdf?src-supplier=Element14; ComponentLink5URL: http://www.mouser.com/ds/2/445/742792608-538481.pdf?src-supplier=Mouser; ComponentLink5Description: http://www.mouser.com/ds/2/445/742792608-538481.pdf?src-supplier=Mouser; ComponentLink6URL: http://www.farnell.com/datasheets/2290671.pdf?src-supplier=Newark; ComponentLink6Description: http://www.farnell.com/datasheets/2290671.pdf?src-supplier=Newark; Supplier 2: Mouser; Supplier Part Number 2: 710-742792608; Stock 2: 6414; Pricing 2: 1=0.18, 10=0.172, 25=0.172, 50=0.168, 100=0.155, 250=0.155 (USD); Manufacturer Part Number: 742792608
R18 R20 = RC0603FR-0710RL: RES 10R OHM 1/10W 1% 0603; Manufacturer: Yageo; Temperature Coefficient: 200ppm/°C; Voltage Rating (DC): 50V; Power Rating: 100mW; Supplier 1: Digi-Key; Supplier Part Number 1: 311-10.0HRCT-ND; Stock 1: 9251104; Pricing 1: 1=0.1, 10=0.046, 100=0.0187, 1000=0.0084, 2500=0.00729 (USD); Case/Package: 0603; Number of Pins: 2; Case Code (Imperial): 0603; Case Code (Metric): 1608; Contact Plating: Tin,Matte; Min Operating Temperature: -55°C; Max Operating Temperature: 155°C; Tolerance: 1%; Composition: Thick Film; Packaging: Tape and Reel; Voltage Rating: 50V; Termination: SMD/SMT; Military Standard: Not; Length: 1.6mm; Height: 0.45mm; Width: 0.8mm; Depth: 0.8mm; Radiation Hardening: No; Lead Free: Lead Free; REACH SVHC: No SVHC; ComponentLink1URL: http://www.farnell.com/datasheets/1868787.pdf?src-supplier=Element14; ComponentLink1Description: http://www.farnell.com/datasheets/1868787.pdf?src-supplier=Element14; ComponentLink2URL: http://www.yageo.com/documents/recent/PYu-RC0603_51_RoHS_L_4.pdf?src-supplier=Avnet; ComponentLink2Description: http://www.yageo.com/documents/recent/PYu-RC0603_51_RoHS_L_4.pdf?src-supplier=Avnet; ComponentLink3URL: http://documents.rs-components.com/techlib://itc_doclist_GB.htm?stockno=5048984&src-supplier=RSComponents; ComponentLink3Description: http://documents.rs-components.com/techlib://itc_doclist_GB.htm?stockno=5048984&src-supplier=RSComponents; ComponentLink4URL: http://www.yageo.com/documents/recent/PYu-RC0603_51_RoHS_L_4.pdf?src-supplier=Avnet+Europe; ComponentLink4Description: http://www.yageo.com/documents/recent/PYu-RC0603_51_RoHS_L_4.pdf?src-supplier=Avnet+Europe; Supplier 2: Mouser; Supplier Part Number 2: 603-RC0603FR-0710RL; Stock 2: 267888; Pricing 2: 1=0.15, 10=0.036, 100=0.012, 1000=0.009, 5000=0.006, 10000=0.006 (USD); Manufacturer Part Number: RC0603FR-0710RL
R19 = RMCF0805FT12K0: RES 12K OHM 1/8W 1% 0805; Manufacturer: Stackpole Electronics; Power Rating: 125mW; Temperature Coefficient: 100ppm/°C; Supplier 1: Digi-Key; Supplier Part Number 1: RMCF0805FT12K0CT-ND; Stock 1: 30304; Pricing 1: 1=0.1, 10=0.026, 100=0.0104, 1000=0.00466, 2500=0.00405 (USD); Mount: Surface Mount; Case/Package: 0805; Case Code (Metric): 2012; Case Code (Imperial): 0805; Contact Plating: Tin,Matte; Min Operating Temperature: -55°C; Max Operating Temperature: 155°C; Packaging: Tape and Reel; Composition: Thick Film; Number of Terminations: 2; Max Power Dissipation: 125mW; Features: Automotive AEC-Q200; Length: 0.079inch; Height: 0.026inch; Width: 0.049inch; Radiation Hardening: No; Lead Free: Lead Free; ComponentLink1URL: https://www.seielect.com/catalog/SEI-RMCF_RMCP.pdf?src-supplier=Avnet; ComponentLink1Description: https://www.seielect.com/catalog/SEI-RMCF_RMCP.pdf?src-supplier=Avnet; ComponentLink2URL: https://www.seielect.com/Catalog/SEI-RMCF_RMCP.pdf?src-supplier=Digi-Key; ComponentLink2Description: https://www.seielect.com/Catalog/SEI-RMCF_RMCP.pdf?src-supplier=Digi-Key; ComponentLink3URL: https://www.seielect.com/catalog/SEI-Packaging.pdf?src-supplier=Digi-Key; ComponentLink3Description: https://www.seielect.com/catalog/SEI-Packaging.pdf?src-supplier=Digi-Key; ComponentLink4URL: http://seielect.com/Catalog/SEI-RMCF_RMCP.pdf?src-supplier=Future+Electronics; ComponentLink4Description: http://seielect.com/Catalog/SEI-RMCF_RMCP.pdf?src-supplier=Future+Electronics; ComponentLink5URL: http://components.arrow.com/part/dataview/40964023S7542466N1174?src-supplier=Arrow; ComponentLink5Description: http://components.arrow.com/part/dataview/40964023S7542466N1174?src-supplier=Arrow; Manufacturer Part Number: RMCF0805FT12K0; Tolerance: 1%
R21 = RDNP_0805: RES DNP 0805; Manufacturer Part Number: CRCW08050000Z0EA; NCM: 8533.21.20
R22-R24 = R10k_1%_1/8W_0805: as R6 on sheet power_schematic; NCM: 8533.21.20
U28 = FT4232HL-REEL: FTDI - FT4232HL-REEL - USB-UART/MPSSE, 4232, QUAD, 64LQFP; Number of Channels: 1; Data Rate: 480Mbps; Operating Supply Voltage: 3.3V; Max Supply Voltage: 3.63V; Min Supply Voltage: 1.62V; Operating Supply Current: 70mA; Number of Transceivers: 4; ESD Protection: Yes; Interface: UART; Supplier 1: Digi-Key; Supplier Part Number 1: 768-1026-1-ND; Manufacturer: FTDI; Stock 1: 18748; Pricing 1: 1=8.3, 10=8.09, 50=7.46, 100=7.14, 500=6.88006 (USD); Mount: Surface Mount; Case/Package: LQFP; Number of Pins: 64; Weight: 0.012088oz; Min Operating Temperature: -40°C; Max Operating Temperature: 85°C; Packaging: Tape and Reel; Package Quantity: 1000; Dual Supply Voltage: 3.3V; Length: 10.1mm; Height: 1.4mm; Width: 10.1mm; Radiation Hardening: No; Lead Free: Lead Free; ComponentLink1URL: http://www.ftdichip.com/Support/Documents/AppNotes/AN_128_User_Guide_For_FT4232H_Factory%20test%20utility.pdf?src-supplier=Digi-Key; ComponentLink1Description: http://www.ftdichip.com/Support/Documents/AppNotes/AN_128_User_Guide_For_FT4232H_Factory%20test%20utility.pdf?src-supplier=Digi-Key; ComponentLink2URL: http://www.alliedelec.com/images/products/datasheets/bm/FTDI/70403916.pdf?src-supplier=Allied+Electronics; ComponentLink2Description: http://www.alliedelec.com/images/products/datasheets/bm/FTDI/70403916.pdf?src-supplier=Allied+Electronics; ComponentLink3URL: http://www.ftdichip.com/Support/Documents/DataSheets/ICs/DS_FT4232H.pdf?src-supplier=Future+Electronics; ComponentLink3Description: http://www.ftdichip.com/Support/Documents/DataSheets/ICs/DS_FT4232H.pdf?src-supplier=Future+Electronics; ComponentLink4URL: https://www.verical.com/server-webapp/html/getDatasheet?partID=643215&src-supplier=Verical; ComponentLink4Description: https://www.verical.com/server-webapp/html/getDatasheet?partID=643215&src-supplier=Verical; ComponentLink5URL: http://datasheet.iiic.cc/ftdi/FT4232HL-REEL.pdf?src-supplier=IIIC; ComponentLink5Description: http://datasheet.iiic.cc/ftdi/FT4232HL-REEL.pdf?src-supplier=IIIC; Supplier 2: Mouser; Supplier Part Number 2: 895-FT4232HL; Stock 2: 21282; Pricing 2: 1=8.3, 25=8.09, 50=7.46, 100=7.14, 500=6.88, 1000=6.08 (USD); Manufacturer Part Number: FT4232HL-REEL
U29 = TPS79333DBVR: TEXAS INSTRUMENTS - TPS79333DBVR - IC, V REG, LINEAR, 0.2A, SOT-23-5; Number of Outputs: 1; Output Voltage: 3.3V; Max Power Dissipation: 560mW; Max Output Current: 200mA; Max Input Voltage: 5.5V; Min Input Voltage: 2.7V; Polarity: Positive; Quiescent Current: 200uA; Accuracy: 2%; Output Type: Fixed; Dropout Voltage: 102mV; Min Current Limit: 285mA; Input Bias Current: 170uA; Supplier 1: Digi-Key; Supplier Part Number 1: 296-12961-1-ND; Manufacturer: Texas Instruments; Stock 1: 21565; Pricing 1: 1=0.73, 10=0.64, 25=0.6016, 100=0.4559, 250=0.388, 500=0.3686, 1000=0.2813 (USD); Case/Package: SOT-23; Number of Pins: 5; Min Operating Temperature: -40°C; Max Operating Temperature: 125°C; Output Current: 200mA; Packaging: Tape and Reel; Package Quantity: 1; Number of Regulators: 1; Min Output Voltage: 3.3V; Power Dissipation: 560mW; Max Output Voltage: 3.3V; Output Voltage Accuracy: 2%; Nominal Output Voltage: 3.3V; Power Rating: 560mW; Max Supply Voltage: 5.5V; Min Supply Voltage: 2.7V; Termination: SMD/SMT; Current Rating: 200mA; Length: 2.9mm; Height: 1.15mm; Width: 1.6mm; Radiation Hardening: No; Lead Free: Lead Free; REACH SVHC: No SVHC; ComponentLink1URL: http://www.ti.com/general/docs/lit/getliterature.tsp?genericPartNumber=TPS793&amp;&amp;fileType=pdf&src-supplier=Farnell; ComponentLink1Description: http://www.ti.com/general/docs/lit/getliterature.tsp?genericPartNumber=TPS793&amp;&amp;fileType=pdf&src-supplier=Farnell; ComponentLink2URL: http://www.jameco.com/Jameco/Products/ProdDS/1123416.pdf?src-supplier=Jameco; ComponentLink2Description: http://www.jameco.com/Jameco/Products/ProdDS/1123416.pdf?src-supplier=Jameco; Supplier 2: Mouser; Supplier Part Number 2: 595-TPS79333DBVR; Stock 2: 31707; Pricing 2: 1=0.72, 10=0.6, 100=0.379, 1000=0.289, 2000=0.282, 3000=0.252, 9000=0.242, 48000=0.233 (USD); Manufacturer Part Number: TPS79333DBVR
XTAL1 = AA-12.000MAGE-T: Crystals 12.000MHz 30ppm 12pF -40C to 85C; Manufacturer: TXC; ESR (Equivalent Series Resistance): 100R; Frequency Stability: 50ppm; Supplier 1: Digi-Key; Supplier Part Number 1: 887-1656-1-ND; Stock 1: 2398; Pricing 1: 1=0.83, 10=0.734, 50=0.6858, 100=0.6061, 500=0.5742 (USD); Mount: Surface Mount; Case/Package: SMD/SMT; Number of Pins: 2; Min Operating Temperature: -40°C; Max Operating Temperature: 85°C; Package Quantity: 1000; Tolerance: 30ppm; Packaging: Tape and Reel; Frequency Tolerance: 30ppm; Termination: SMD/SMT; Length: 0.197inch; Height: 0.053inch; Width: 3.2mm; Ratings: AEC-Q200; REACH SVHC: No SVHC; ComponentLink1URL: http://www.txccrystal.com/images/pdf/number-crystal-automotive.pdf?src-supplier=Digi-Key; ComponentLink1Description: http://www.txccrystal.com/images/pdf/number-crystal-automotive.pdf?src-supplier=Digi-Key; ComponentLink2URL: http://www.farnell.com/datasheets/1811860.pdf?src-supplier=Element14; ComponentLink2Description: http://www.farnell.com/datasheets/1811860.pdf?src-supplier=Element14; Supplier 2: Mouser; Supplier Part Number 2: 717-AA-12.000MAGE-T; Stock 2: 4856; Pricing 2: 1=0.83, 10=0.734, 50=0.685, 100=0.606, 500=0.574, 1000=0.435 (USD); Manufacturer Part Number: AA-12.000MAGE-T